# EAGLE design adapter (EAGLE 6.1)
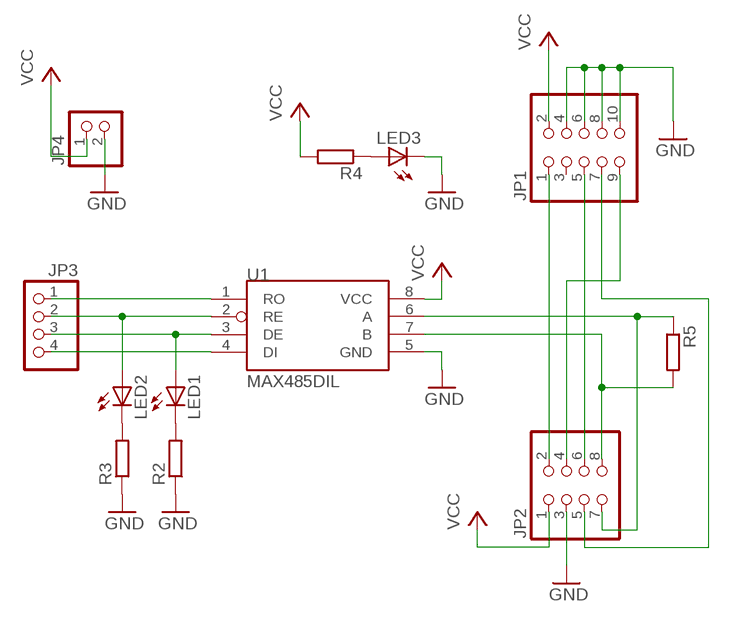
[diagram p0: schematic, sheet 1]

## Parts
JP1  PINHD-2X5  [2X05]
JP2  PINHD-2X4  [2X04]
JP3  PINHD-1X4  [1X04]
JP4  PINHD-1X2  [1X02]
LED1  LEDCHIPLED_0805  [CHIPLED_0805]
LED2  LEDCHIPLED_0805  [CHIPLED_0805]
LED3  LEDCHIPLED_0805  [CHIPLED_0805]
R2  R-EU_R0805  [R0805]
R3  R-EU_R0805  [R0805]
R4  R-EU_R0805  [R0805]
R5  R-EU_R0805  [R0805]
U1  MAX485DIL  [DIL08]

## Nets
A: JP2.7 R5.1 U1.6(A)
B: JP2.8 R5.2 U1.7(B)
GND: JP1.4 JP1.6 JP1.8 JP1.10 JP2.3 JP4.2 LED3.C R2.1 R3.1 U1.5(GND)
MISO: JP1.9 JP2.4
MOSI: JP1.1 JP2.2
N$1: JP3.1 U1.1(RO)
N$2: JP3.2 LED2.A U1.2(RE)
N$3: JP3.3 LED1.A U1.3(DE)
N$4: JP3.4 U1.4(DI)
N$5: LED2.C R3.2
N$6: LED1.C R2.2
N$16: LED3.A R4.1
RST: JP1.5 JP2.6
SCK: JP1.7 JP2.5
VCC: JP1.2 JP2.1 JP4.1 R4.2 U1.8(VCC)
Unconnected: JP1.3

## Library data of the parts
JP1 = pinhead:PINHD-2X5: PIN HEADER
JP2 = pinhead:PINHD-2X4: PIN HEADER
JP3 = pinhead:PINHD-1X4: PIN HEADER
JP4 = pinhead:PINHD-1X2: PIN HEADER
LED1-LED3 = led:LED: LED OSRAM: - CHIPLED LG R971, LG N971, LY N971, LG Q971, LY Q971, LO R971, LY R971 LH N974, LH R974 LS Q976, LO Q976, LY Q976 LO Q996 - Hyper CHIPLED LW Q18S LB Q993, LB Q99A, LB R99A - SideLED LS A670, LO A670, LY A670, LG A670, LP A670 LB A673, LV A673, LT A673, LW A673 LH A674 LY A675 LS A676, LA A676, LO A676, LY A676, LW A676 LS A679, LY A679, LG A679 - Hyper Micro SIDELED® LS Y876, LA Y876, LO Y876, LY Y876 LT Y87S - SmartLED LW L88C, LW L88S LB L89C, LB L89S, LG L890 LS L89K, LO L89K, LY L89K LS L896, LA L896, LO L896, LY L896 - TOPLED LS T670, LO T670, LY T670, LG T670, LP T670 LSG T670, LSP T670, LSY T670, LOP T670, LYG T670 LG T671, LOG T671, LSG T671 LB T673, LV T673, LT T673, LW T673 LH T674 LS T676, LA T676, LO T676, LY T676, LB T676, LH T676, LSB T676, LW T676 LB T67C, LV T67C, LT T67C, LS T67K, LO T67K, LY T67K, LW E67C LS E67B, LA E67B, LO E67B, LY E67B, LB E67C, LV E67C, LT E67C LW T67C LS T679, LY T679, LG T679 LS T770, LO T770, LY T770, LG T770, LP T770 LB T773, LV T773, LT T773, LW T773 LH T774 LS E675, LA E675, LY E675, LS T675 LS T776, LA T776, LO T776, LY T776, LB T776 LHGB T686 LT T68C, LB T68C - Hyper Mini TOPLED® LB M676 - Mini TOPLED Santana® LG M470 LS M47K, LO M47K, LY M47K Source: http://www.osram.convergy.de LUXEON: - LUMILED® LXK2-PW12-R00, LXK2-PW12-S00, LXK2-PW14-U00, LXK2-PW14-V00 LXK2-PM12-R00, LXK2-PM12-S00, LXK2-PM14-U00 LXK2-PE12-Q00, LXK2-PE12-R00, LXK2-PE12-S00, LXK2-PE14-T00, LXK2-PE14-U00 LXK2-PB12-K00, LXK2-PB12-L00, LXK2-PB12-M00, LXK2-PB14-N00, LXK2-PB14-P00, LXK2-PB14-Q00 LXK2-PR12-L00, LXK2-PR12-M00, LXK2-PR14-Q00, LXK2-PR14-R00 LXK2-PD12-Q00, LXK2-PD12-R00, LXK2-PD12-S00 LXK2-PH12-R00, LXK2-PH12-S00 LXK2-PL12-P00, LXK2-PL12-Q00, LXK2-PL12-R00 Source: www.luxeon.com KINGBRIGHT: KA-3528ASYC Source: www.kingbright.com
R2-R5 = rcl:R-EU_: RESISTOR, European symbol
U1 = SparkFun:MAX485

## Board
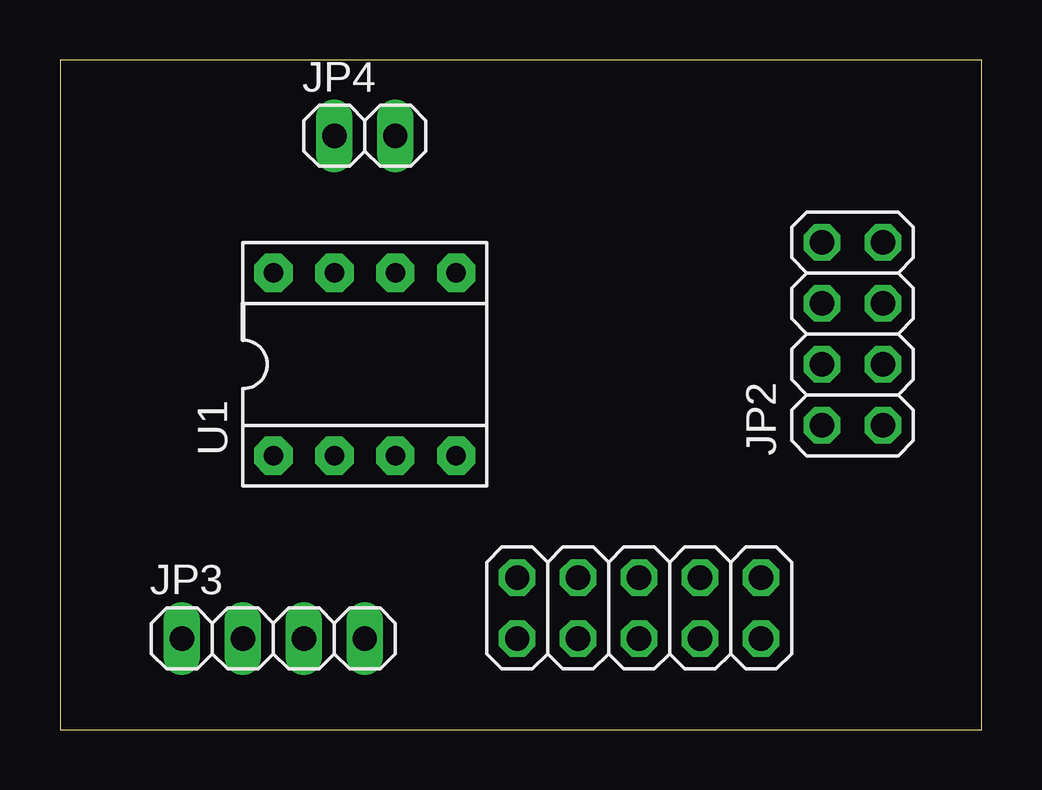
[diagram p1: board, top side]
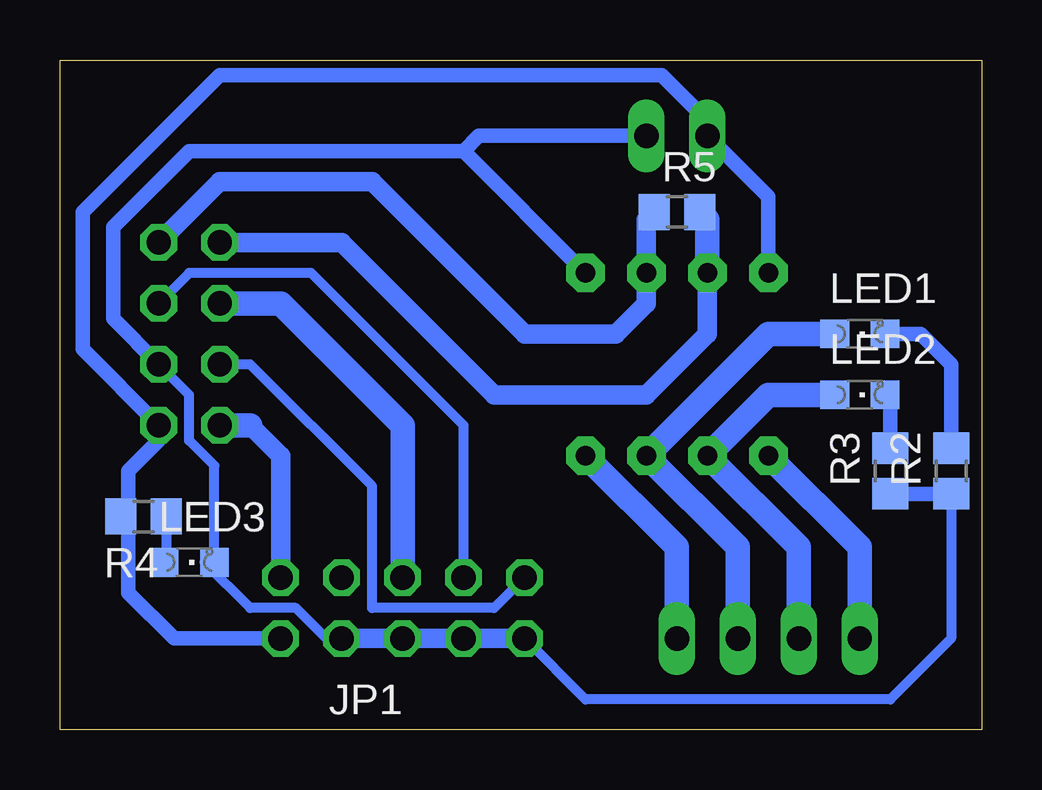
[diagram p2: board, bottom side, seen from below]

Size 38.41 x 27.93 mm. Coordinates in mm from the lower left corner, seen from the top.
Outline: 0,0 38.41,0 38.41,27.93 0,27.93 0,0
Copper layers (1*16): Top 0.035mm / dielectric 1.5mm / Bottom 0.035mm
Design rules: minimum track width 10mil, minimum drill 24mil, track to track 8mil, track to pad 8mil, pad to pad 8mil, via to via 8mil, smd to smd 8mil, copper to edge 40mil, drill to drill 8mil, minimum pad ring 10mil, minimum via ring 8mil, stop-mask expansion 4mil, vias tented up to drill 0mil, thermal gap 10mil

### Footprints (pad centres in the part's own frame; a part is rotated, then mirrored left to right if it is on the bottom)
2X05 = drill 1.016 octagon: 1 -5.08,-1.27; 2 -5.08,1.27; 3 -2.54,-1.27; 4 -2.54,1.27; 5 0,-1.27; 6 0,1.27; 7 2.54,-1.27; 8 2.54,1.27; 9 5.08,-1.27; 10 5.08,1.27
2X04 = drill 1.016 octagon: 1 -3.81,-1.27; 2 -3.81,1.27; 3 -1.27,-1.27; 4 -1.27,1.27; 5 1.27,-1.27; 6 1.27,1.27; 7 3.81,-1.27; 8 3.81,1.27
1X04 = drill 1.016 long: 1 -3.81,0; 2 -1.27,0; 3 1.27,0; 4 3.81,0
1X02 = drill 1.016 long: 1 -1.27,0; 2 1.27,0
CHIPLED_0805 = smd 1.2 x 1.2: A 0,-1.05; C 0,1.05
R0805 = smd 1.3 x 1.5: 1 -0.95,0; 2 0.95,0
DIL08 = drill 0.813 pad 1.6 octagon: 1 -3.81,-3.81; 2 -1.27,-3.81; 3 1.27,-3.81; 4 3.81,-3.81; 5 3.81,3.81; 6 1.27,3.81; 7 -1.27,3.81; 8 -3.81,3.81

### Placement (x,y rotation side)
JP1  24.13,5.08 180 top
JP2  33.02,16.51 90 top
JP3  8.89,3.81 0 top
JP4  12.7,24.77 0 top
LED1  5.08,16.51 270 bottom
LED2  5.08,13.97 270 bottom
LED3  33.02,6.99 270 bottom
R2  1.27,10.79 90 bottom
R3  3.81,10.79 90 bottom
R4  34.92,8.89 180 bottom
R5  12.7,21.59 0 bottom
U1  12.7,15.24 0 top

### Tracks (layer width: path | path; a pad name or v marks a point on that pad's centre or on a via)
A
  Bottom 0.813: R5.1 13.97,21.27 U1.6 13.97,17.78 15.24,16.51 19.05,16.51 25.4,22.86 31.75,22.86 JP2.7
B
  Bottom 0.813: JP2.8 26.67,20.32 20.32,13.97 13.97,13.97 11.43,16.51 U1.7
  Bottom 1.016: U1.7 11.43,21.27 R5.2
GND
  Bottom 0.406: JP1.4 27.3,3.81 28.57,5.08 30.48,5.08 32.38,6.99 LED3.C | LED3.C 31.75,6.99 | LED3.C 31.97,11.02 33.02,12.06 33.02,13.97 JP2.3 | R2.1 1.27,3.81 3.81,1.27 16.51,1.27 JP1.10
  Bottom 0.61: JP2.3 36.2,17.14 36.2,20.95 33.02,24.13 21.59,24.13 | 21.59,24.13 U1.5 | JP4.2 20.95,24.77 21.59,24.13 | R3.1 R2.1
  Bottom 0.813: JP1.4 JP1.6 JP1.8 JP1.10
MISO
  Bottom 0.406: JP1.9 20.32,5.08 25.4,5.08 25.4,10.16 30.48,15.24 JP2.4
MOSI
  Bottom 0.813: JP1.1 29.21,11.43 30.48,12.7
  Bottom 1.016: JP2.2 30.48,12.7
N$1
  Bottom 1.016: JP3.1 5.08,7.62 U1.1
N$2
  Bottom 1.016: LED2.A 8.89,13.97 U1.2 7.62,7.62 JP3.2
N$3
  Bottom 1.016: LED1.A 8.89,16.51 U1.3 10.16,7.62 JP3.3
N$4
  Bottom 1.016: JP3.4 12.7,7.62 U1.4
N$5
  Bottom 0.61: R3.2 3.81,13.75 LED2.C
N$6
  Bottom 0.61: LED1.C 2.54,16.51 1.27,15.24 R2.2 1.27,11.43
N$16
  Bottom 0.406: R4.1 33.98,7.3 34.29,6.99 LED3.A
RST
  Bottom 1.016: JP2.6 29.21,17.78 24.13,12.7 JP1.5
SCK
  Bottom 0.406: JP1.7 21.59,12.7 27.94,19.05 33.02,19.05 JP2.5
VCC
  Bottom 0.61: U1.8 8.89,22.23 JP4.1 11.43,25.4 13.34,27.3 31.75,27.3 37.47,21.59 37.47,15.88 JP2.1 34.29,12.06 35.56,10.79 35.56,9.21 R4.2 35.56,8.57 35.56,5.71 33.66,3.81 JP1.2